# EAGLE design fet-dd-charger-20mm-mk-1.1-top (EAGLE 7.5.0)
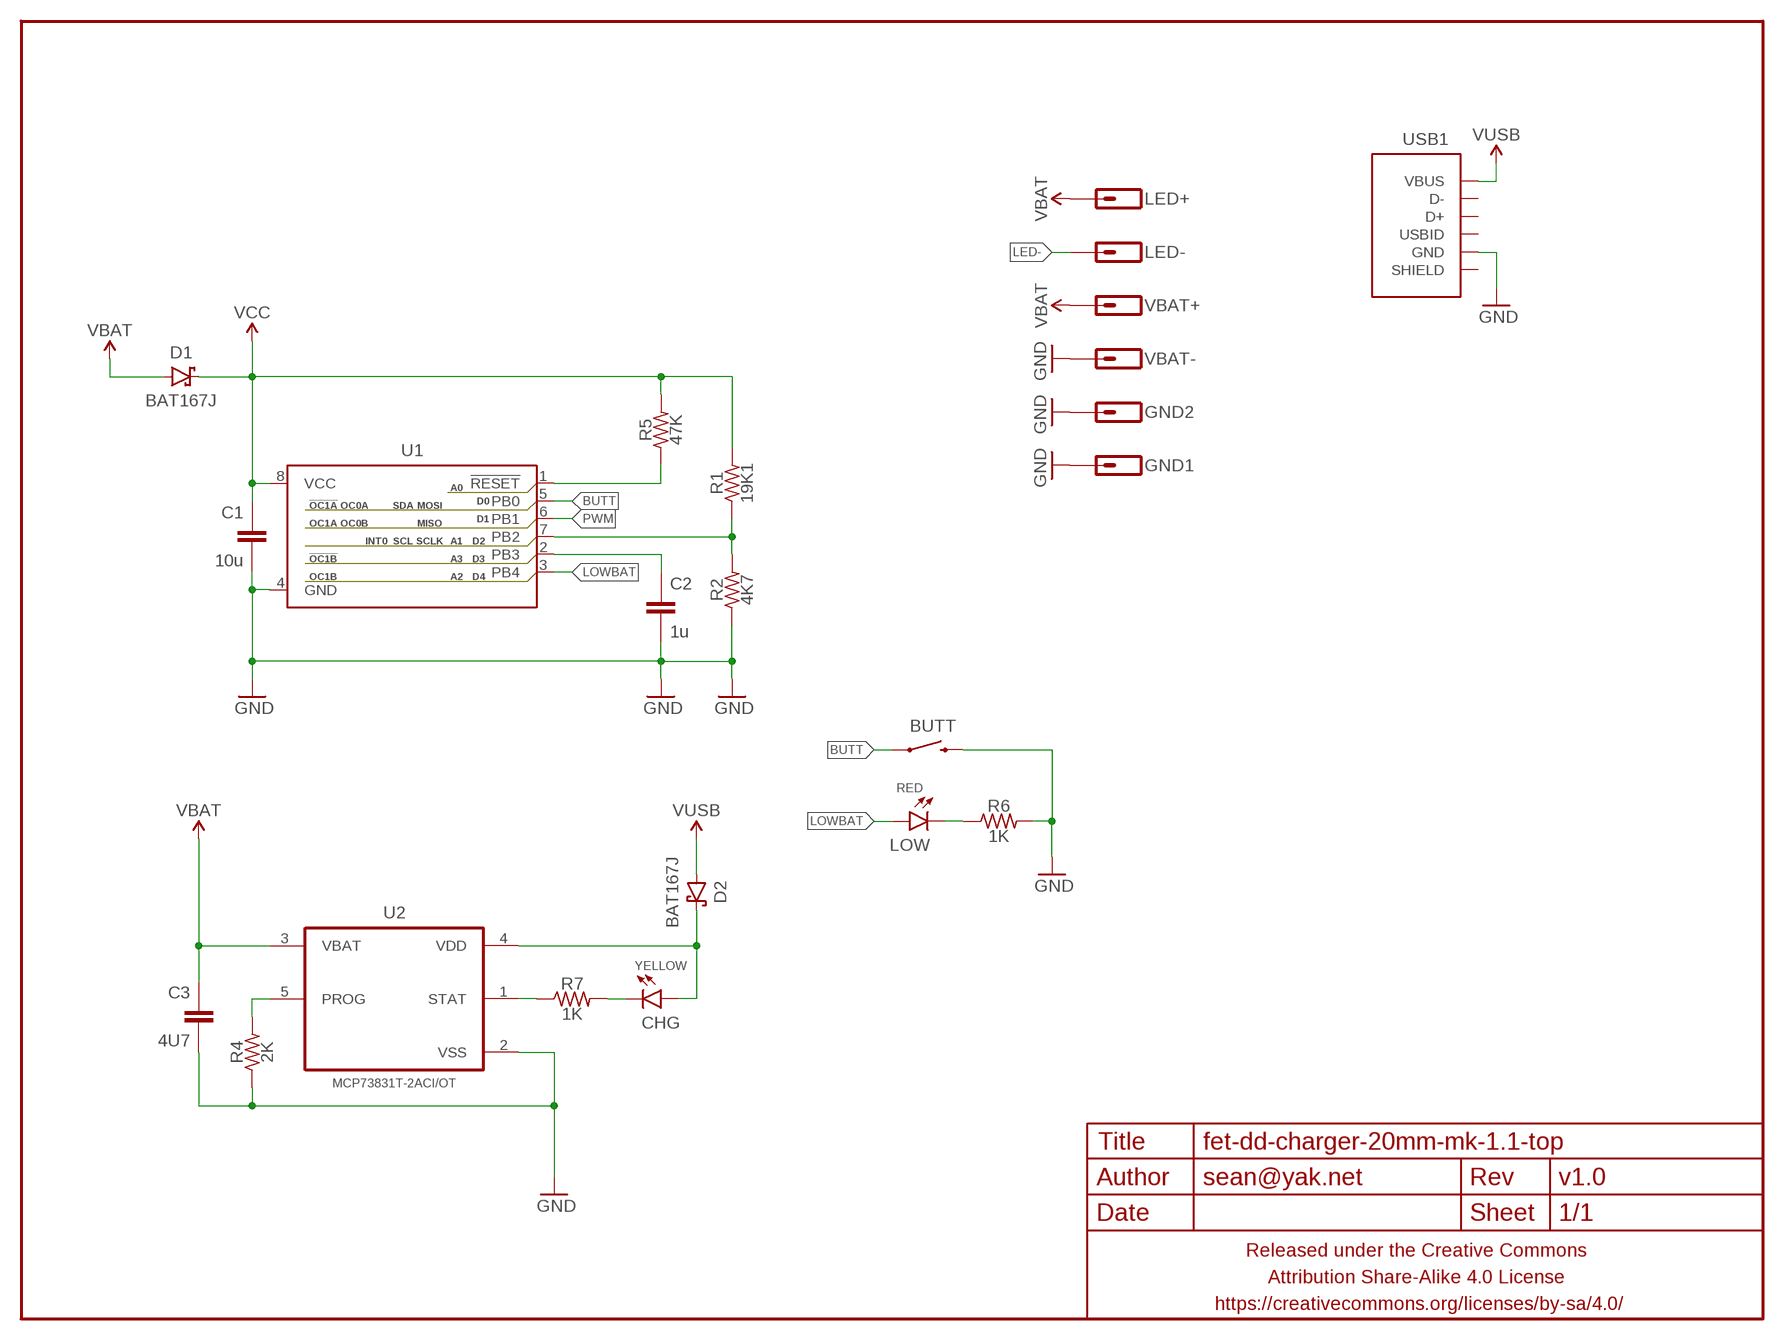
[diagram p0: schematic, sheet 1]

## Parts
BUTT  SWITCH-MOMENTARY-2PTH-RA  [TACTILE-PTH-SIDE]
C1  10u  CAPACITOR-CERAMICC0603-TIGHTER  [C0603-TIGHTER]
C2  1u  CAPACITOR-CERAMICC0603-TIGHTER  [C0603-TIGHTER]
C3  4U7  CAPACITOR-CERAMICC0603-TIGHTER  [C0603-TIGHTER]
CHG  YELLOW  LED0603-TIGHT  [LED-0603-TIGHT]
D1  BAT167J  DIODE-SCHOTTKYSOD323  [SOD323-SCHOTTKY]
D2  BAT167J  DIODE-SCHOTTKYSOD323  [SOD323-SCHOTTKY]
FRAME1  FRAME-LETTERNO_PACKAGE  [DUMMY]
GND1  M01PTH_2MM  [1X01_2MM]
GND2  M01PTH_2MM  [1X01_2MM]
LED+  M01PTH_2MM  [1X01_2MM]
LED-  M01PTH_2MM  [1X01_2MM]
LOW  RED  LED0603-TIGHT  [LED-0603-TIGHT]
R1  19K1  RESISTORR0603-TIGHTER  [R0603-TIGHTER]
R2  4K7  RESISTORR0603-TIGHTER  [R0603-TIGHTER]
R4  2K  RESISTORR0603-TIGHTER  [R0603-TIGHTER]
R5  47K  RESISTORR0402  [R0402]
R6  1K  RESISTORR0603-TIGHTER  [R0603-TIGHTER]
R7  1K  RESISTORR0603-TIGHTER  [R0603-TIGHTER]
U1  ATTINY13SOIC-NARROWPADS  [SO08-NARROWER]
U2  MCP73831T-2ACI/OT  [SOT95P280X145-5N]
USB1  USB-AB-SHIELDFCI-10118193-USB-MICRO-B  [FCI-10118193-USB-MICRO-B]
VBAT+  M01NOSTOP-CANTSTOP-DONTKNOWHOWTOSTOP  [1X01_SMD_NOSTOP_NOSILK]
VBAT-  M01NOT-A-VIA-NOPE  [1X01_NOSILK_NOSTOP]

## Nets
BUTT: BUTT.1 U1.5(PB0)
GND: BUTT.2 C1.2 C2.2 C3.2 GND1.1 GND2.1 R2.1 R4.1 R6.2 U1.4(GND) U2.2(VSS) USB1.5(GND) VBAT-.P$1
LED-: LED-.1
LOWBAT: LOW.A U1.3(PB4)
N$1: R5.1 U1.1(!RESET)
N$2: R1.1 R2.2 U1.7(PB2)
N$3: C2.1 U1.2(PB3)
N$4: R4.2 U2.5(PROG)
N$5: CHG.A D2.C U2.4(VDD)
N$6: LOW.C R6.1
N$8: CHG.C R7.2
N$9: R7.1 U2.1(STAT)
PWM: U1.6(PB1)
VBAT: C3.1 D1.A LED+.1 U2.3(VBAT) VBAT+.1
VCC: C1.1 D1.C R1.2 R5.2 U1.8(VCC)
VUSB: D2.A USB1.1(VBUS)
Unconnected: USB1.2(D-) USB1.3(D+) USB1.4(USBID) USB1.SHIELD@1(SHIELD) USB1.SHIELD@2(SHIELD) USB1.SHIELD@3(SHIELD) USB1.SHIELD@4(SHIELD)

## Library data of the parts
BUTT = a_parts:SWITCH-MOMENTARY-2: Various NO switches- pushbuttons, reed, etc
C1-C3 = a_parts:CAPACITOR-CERAMIC: CAPACITOR, European symbol
CHG LOW = a_parts:LED: LEDs Standard schematic elements and footprints for 5mm, 3mm, 1206, and 0603 sized LEDs. 5mm - Spark Fun Electronics SKU : COM-00529 (and others)
D1 D2 = a_parts:DIODE-SCHOTTKY: Schottky diodes in SFE's production catalog BAT20J 1A 23V 0.62Vf RB751 120mA 40V 0.37Vf PMEG4005EJ 0.5A 40V 0.42Vf MBRA140 1A 40V 0.5Vf B340A 3A 40V SMA
FRAME1 = a_parts:FRAME-LETTER: Schematic Frame Standard 8.5x11 US Letter frame; DESIGNER: sean@yak.net; VERSION: v1.0
GND1 GND2 LED+ LED- VBAT+ VBAT- = a_parts:M01: Header 1 Standard 1-pin 0.1" header. Use with straight break away headers (SKU : PRT-00116), right angle break away headers (PRT-00553), swiss pins (PRT-00743), machine pins (PRT-00117), and female headers (PRT-00115).
R1 R2 R4-R7 = a_parts:RESISTOR: RESISTOR, American symbol
U1 = a_parts:ATTINY13: Atmel 8-pin 1kB flash uC
U2 = a_parts:MCP73831T-2ACI/OT: Charge Management Controller; MPN: MCP73831T-2ACI/OT; OC_FARNELL: 1332158; OC_NEWARK: 56K7045; PACKAGE: SOT-5; SUPPLIER: Microchip
USB1 = a_parts:USB-AB-SHIELD

## Board
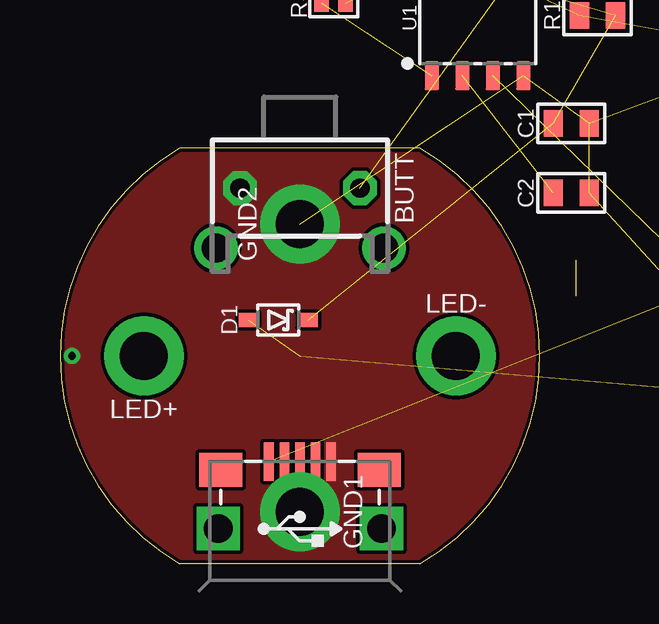
[diagram p1: board, top side]
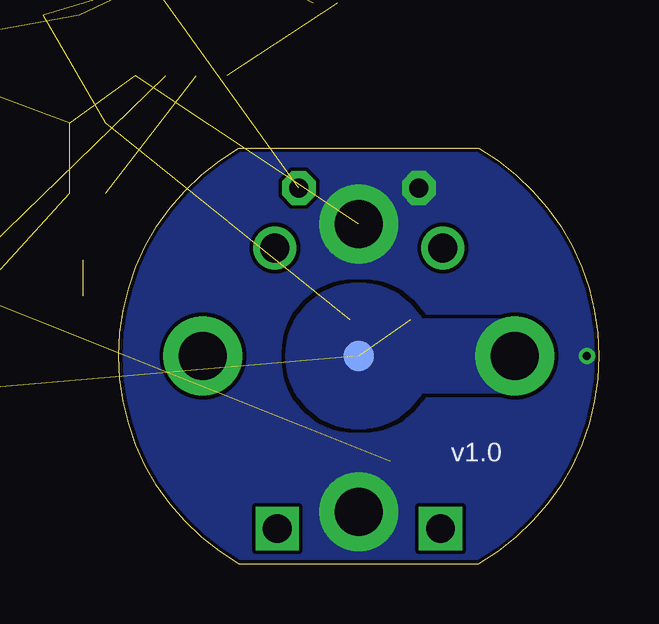
[diagram p2: board, bottom side, seen from below]

Size 21.5 x 17.32 mm. Coordinates in mm from the lower left corner, seen from the top.
Outline: 21.5,12.66 21.5,11.16
Outline: 15,0 5,0 arc-120 5,17.32 15,17.32 arc-120 15,0
Copper layers (1*16): Top 0.0356mm / dielectric 1.5011mm / Bottom 0.0356mm
Design rules "LaenPCBOrder2": minimum track width 6mil, minimum drill 13mil, track to track 6mil, track to pad 6mil, pad to pad 6mil, via to via 6mil, smd to smd 6mil, copper to edge 6mil, drill to drill 6mil, minimum pad ring 7mil, minimum via ring 7mil, stop-mask expansion 3mil, vias tented up to drill 20mil, thermal gap 10mil

### Footprints (pad centres in the part's own frame; a part is rotated, then mirrored left to right if it is on the bottom)
TACTILE-PTH-SIDE = drill 0.8 pad 1.4 octagon: 1 -2.5,0; 2 2.5,0 | drill 1.2 pad 1.778: ANCHOR1 -3.5,2.5; ANCHOR2 3.5,2.5
C0603-TIGHTER = smd 0.8 x 1.1: 1 -0.75,0; 2 0.75,0
LED-0603-TIGHT = smd 0.8 x 1.1: A 0.75,0; C -0.75,0
SOD323-SCHOTTKY = smd 0.8 x 0.6: A -1.25,0; C 1.25,0
1X01_2MM = drill 2 pad 3.302: 1 0,0
R0603-TIGHTER = smd 0.8 x 1.1: 1 -0.75,0; 2 0.75,0
R0402 = smd 0.6 x 0.7: 1 -0.5,0; 2 0.5,0
SO08-NARROWER = smd 0.6 x 1.2: 1 -1.905,-2.416; 2 -0.635,-2.416; 3 0.635,-2.416; 4 1.905,-2.416; 5 1.905,2.416; 6 0.635,2.416; 7 -0.635,2.416; 8 -1.905,2.416
SOT95P280X145-5N = smd 1.3 x 0.55: 1 -1.4,0.95; 2 -1.4,0; 3 -1.4,-0.95; 4 1.4,-0.95; 5 1.4,0.95
FCI-10118193-USB-MICRO-B = smd 0.4 x 1.6: 1 -1.3,2.8; 2 -0.65,2.8; 3 0,2.8; 4 0.65,2.8; 5 1.3,2.8 | smd 1.8 x 1.4: SHIELD@1 -3.3,2.45; SHIELD@2 3.3,2.45 | drill 1.2 pad 1.8 square: SHIELD@3 -3.4,0; SHIELD@4 3.4,0
1X01_SMD_NOSTOP_NOSILK = smd 1.27 x 1.27: 1 0,0
1X01_NOSILK_NOSTOP = drill 0.33: P$1 0,0

### Placement (x,y rotation side)
BUTT  10,15.66 180 top
C1  21.3,18.36 0 top
C2  21.3,15.46 0 top
C3  31,4.66 180 top  (outside the outline)
CHG  36.5,13.16 180 top  (outside the outline)
D1  9.1,10.16 0 top
D2  28.5,11.66 0 top  (outside the outline)
FRAME1  0,-1.34 0 top
GND1  10,2.16 0 top
GND2  10,14.16 90 top
LED+  3.5,8.66 90 top
LED-  16.5,8.66 270 top
LOW  36.5,3.16 180 top  (outside the outline)
R1  22.4,22.86 0 top  (outside the outline)
R2  30.3,21.16 0 top  (outside the outline)
R4  28,8.16 270 top  (outside the outline)
R5  11.4,23.36 0 top  (outside the outline)
R6  34,1.16 180 top  (outside the outline)
R7  34,15.66 0 top  (outside the outline)
U1  17.4,22.76 0 top  (outside the outline)
U2  31,8.16 90 top  (outside the outline)
USB1  10,1.46 0 top
VBAT+  10,8.66 0 bottom
VBAT-  0.5,8.66 0 top

### Tracks (layer width: path | path; a pad name or v marks a point on that pad's centre or on a via)
BUTT  (1 unrouted)
GND  (8 unrouted)
  pour Bottom (isolate 0.152, rank 6, no thermals): 0,18.66 20,18.66 20,-1.34 0,-1.34
  pour Top (isolate 0.152, rank 6, no thermals): 20,18.66 0,18.66 0,-1.34 20,-1.34
LOWBAT  (1 unrouted)
N$1  (1 unrouted)
N$2  (2 unrouted)
N$3  (1 unrouted)
N$4  (1 unrouted)
N$5  (2 unrouted)
N$6  (1 unrouted)
N$8  (1 unrouted)
N$9  (1 unrouted)
VBAT  (3 unrouted)
  pour Bottom (isolate 0.152, rank 2, no thermals): 10.5,10.16 3.5,10.16 2.5,9.16 2.5,8.16 3.5,7.16 10.5,7.16
  pour Bottom (isolate 0.152, no thermals): 7,8.66 arc-180 13,8.66 arc-180
VCC  (4 unrouted)
VUSB  (1 unrouted)